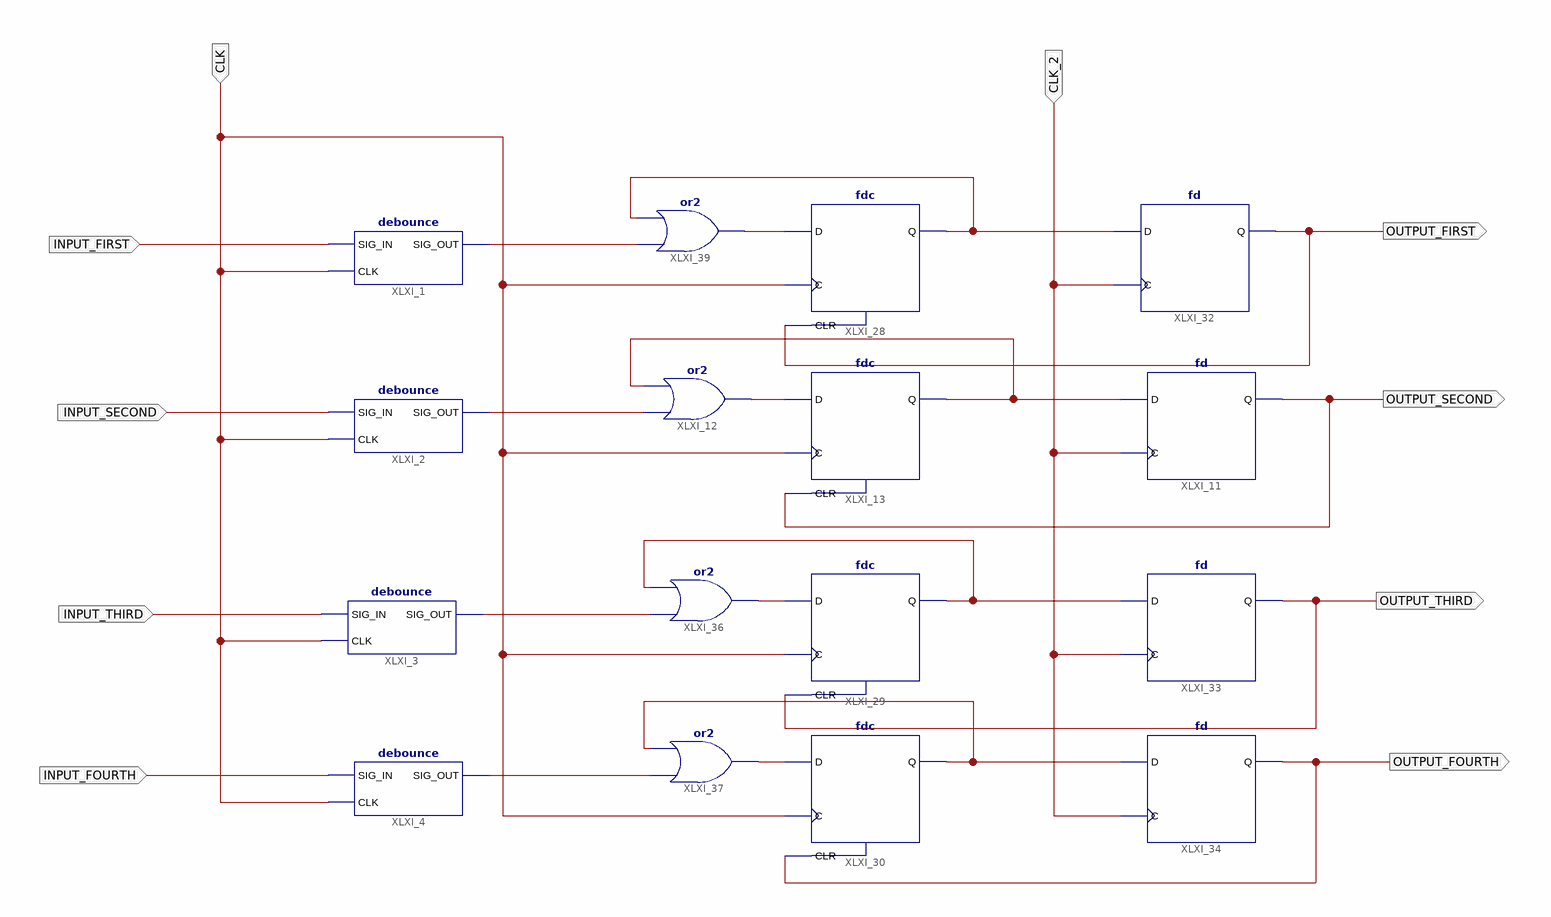
[diagram p0: schematic sheet 1]
// Xilinx ISE schematic DebounceSync.sch (spartan6) as structural Verilog: 16 symbols, 10 ports
module DebounceSync (
  input  INPUT_FIRST,
  input  CLK_2,
  input  INPUT_FOURTH,
  input  INPUT_THIRD,
  input  INPUT_SECOND,
  input  CLK,
  output OUTPUT_FIRST,
  output OUTPUT_FOURTH,
  output OUTPUT_THIRD,
  output OUTPUT_SECOND
);

  wire XLXN_8, XLXN_9, XLXN_12, XLXN_43, XLXN_44, XLXN_46, XLXN_49, XLXN_50, XLXN_51, XLXN_54, XLXN_55,
       XLXN_56;

  debounce XLXI_1 (.SIG_IN(INPUT_FIRST), .CLK(CLK), .SIG_OUT(XLXN_49));
  debounce XLXI_4 (.SIG_IN(INPUT_FOURTH), .CLK(CLK), .SIG_OUT(XLXN_51));
  debounce XLXI_3 (.SIG_IN(INPUT_THIRD), .CLK(CLK), .SIG_OUT(XLXN_50));
  debounce XLXI_2 (.SIG_IN(INPUT_SECOND), .CLK(CLK), .SIG_OUT(XLXN_12));
  or XLXI_12 (XLXN_8, XLXN_12, XLXN_9);
  fdc XLXI_13 (.C(CLK), .CLR(OUTPUT_SECOND), .D(XLXN_8), .Q(XLXN_9));
  fd XLXI_11 (.C(CLK_2), .D(XLXN_9), .Q(OUTPUT_SECOND));
  fdc XLXI_28 (.C(CLK), .CLR(OUTPUT_FIRST), .D(XLXN_46), .Q(XLXN_56));
  fdc XLXI_29 (.C(CLK), .CLR(OUTPUT_THIRD), .D(XLXN_43), .Q(XLXN_55));
  fdc XLXI_30 (.C(CLK), .CLR(OUTPUT_FOURTH), .D(XLXN_44), .Q(XLXN_54));
  fd XLXI_32 (.C(CLK_2), .D(XLXN_56), .Q(OUTPUT_FIRST));
  fd XLXI_33 (.C(CLK_2), .D(XLXN_55), .Q(OUTPUT_THIRD));
  fd XLXI_34 (.C(CLK_2), .D(XLXN_54), .Q(OUTPUT_FOURTH));
  or XLXI_36 (XLXN_43, XLXN_50, XLXN_55);
  or XLXI_37 (XLXN_44, XLXN_51, XLXN_54);
  or XLXI_39 (XLXN_46, XLXN_49, XLXN_56);
endmodule
